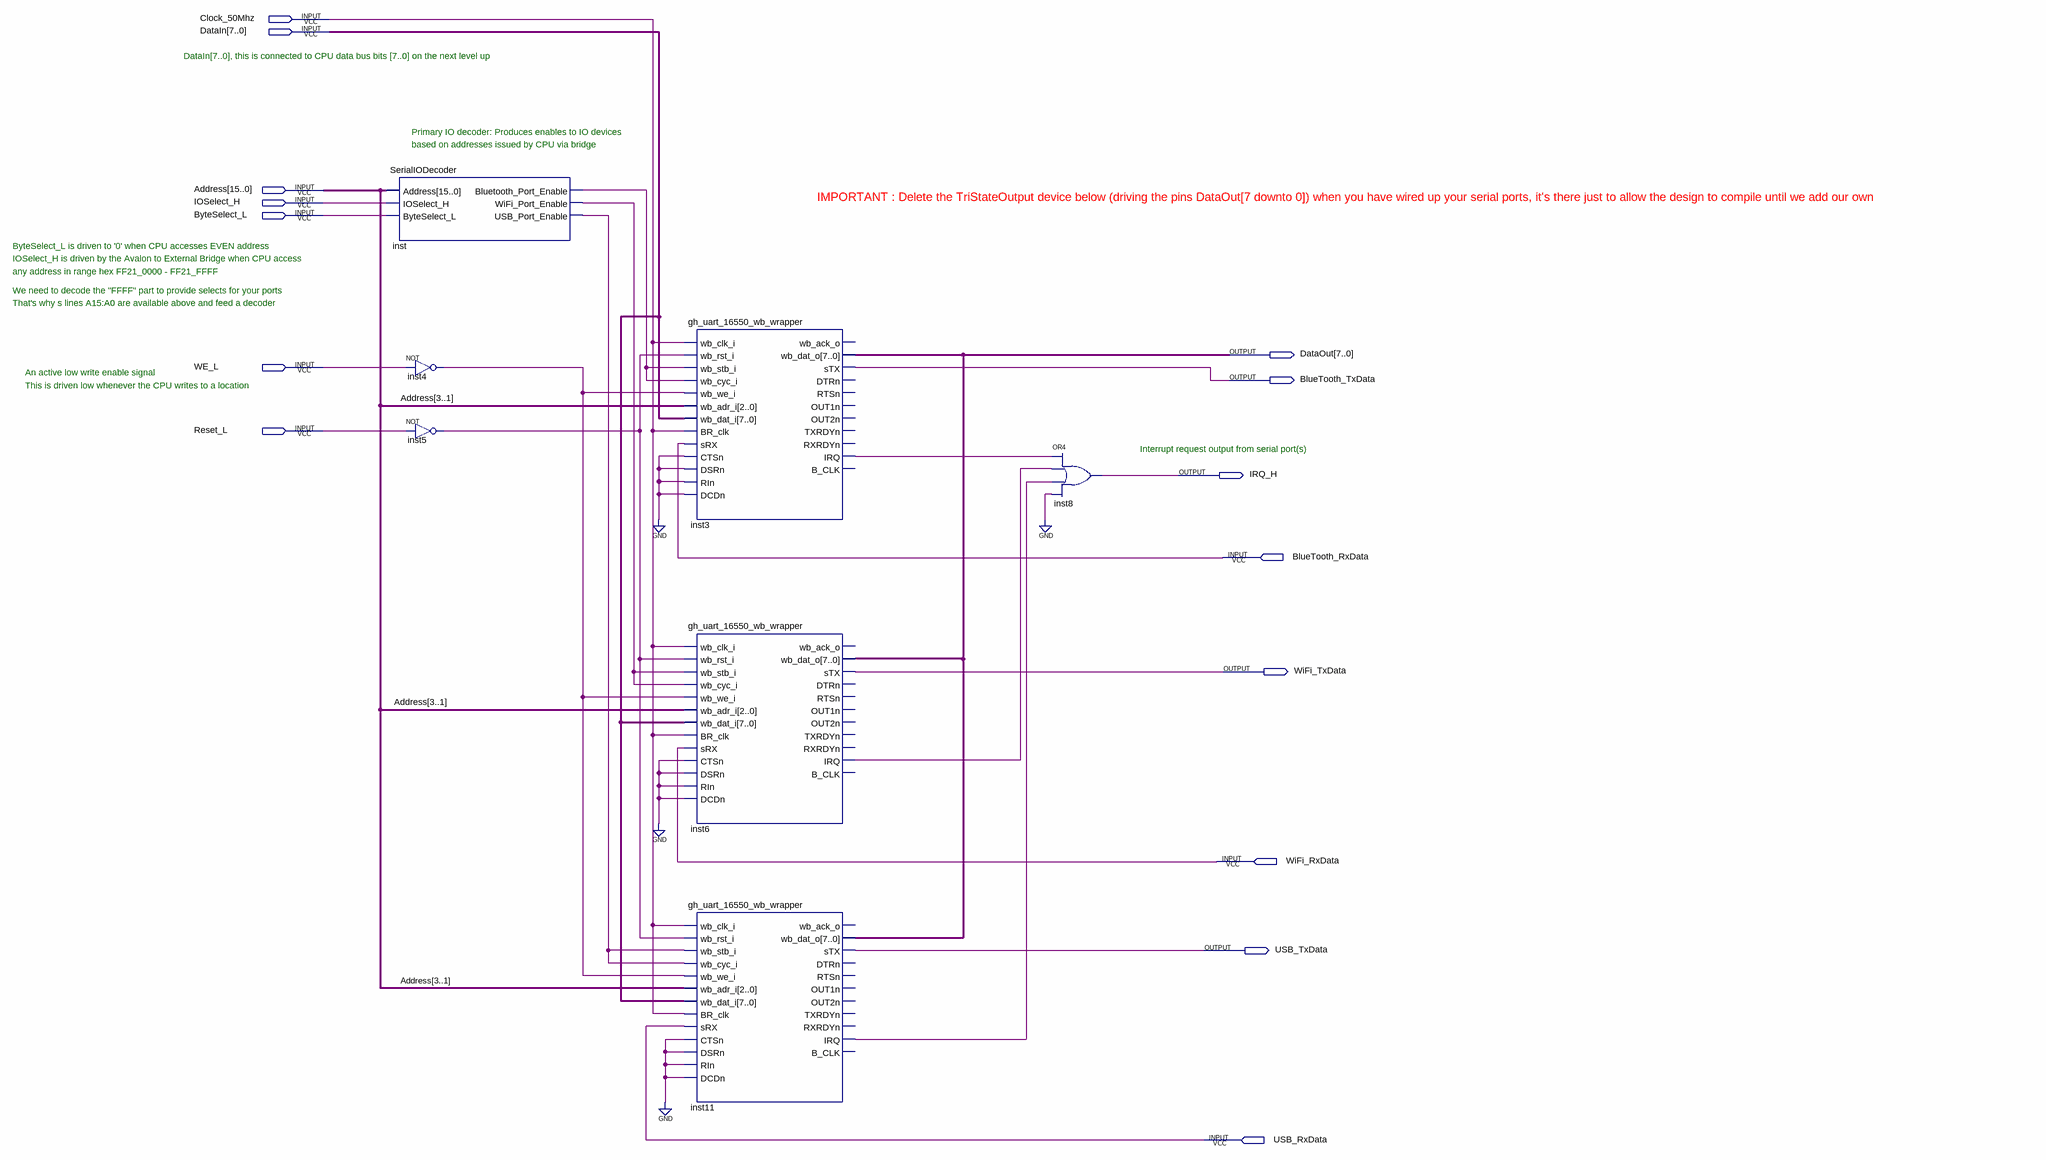
[diagram p0: schematic sheet]
// Quartus schematic OnChipSerialIO.bdf as structural Verilog: 7 symbols, 15 pins
module OnChipSerialIO (
  input  Clock_50Mhz,
  input  [7:0] DataIn,
  input  [15:0] Address,
  input  IOSelect_H,
  input  ByteSelect_L,
  input  WE_L,
  input  Reset_L,
  input  BlueTooth_RxData,
  input  WiFi_RxData,
  input  USB_RxData,
  output [7:0] DataOut,
  output BlueTooth_TxData,
  output IRQ_H,
  output WiFi_TxData,
  output USB_TxData
);

  wire inst3_irq, inst4_out, inst5_out, inst6_irq, inst11_irq, inst_bluetooth_port_enable,
       inst_usb_port_enable, inst_wifi_port_enable;

  SerialIODecoder inst (
    .Address(Address), .IOSelect_H(IOSelect_H), .ByteSelect_L(ByteSelect_L),
    .Bluetooth_Port_Enable(inst_bluetooth_port_enable), .WiFi_Port_Enable(inst_wifi_port_enable),
    .USB_Port_Enable(inst_usb_port_enable));
  not inst4 (inst4_out, WE_L);
  not inst5 (inst5_out, Reset_L);
  gh_uart_16550_wb_wrapper inst3 (
    .wb_clk_i(Clock_50Mhz), .wb_rst_i(inst5_out), .wb_stb_i(inst_bluetooth_port_enable),
    .wb_cyc_i(inst_bluetooth_port_enable), .wb_we_i(inst4_out), .wb_adr_i(Address[3:1]), .wb_dat_i(DataIn),
    .BR_clk(Clock_50Mhz), .sRX(BlueTooth_RxData), .CTSn(1'b0), .DSRn(1'b0), .RIn(1'b0), .DCDn(1'b0),
    .wb_dat_o(DataOut), .sTX(BlueTooth_TxData), .IRQ(inst3_irq));  // open: wb_ack_o, DTRn, RTSn, OUT1n, OUT2n, TXRDYn, RXRDYn, B_CLK
  gh_uart_16550_wb_wrapper inst6 (
    .wb_clk_i(Clock_50Mhz), .wb_rst_i(inst5_out), .wb_stb_i(inst_wifi_port_enable),
    .wb_cyc_i(inst_wifi_port_enable), .wb_we_i(inst4_out), .wb_adr_i(Address[3:1]), .wb_dat_i(DataIn),
    .BR_clk(Clock_50Mhz), .sRX(WiFi_RxData), .CTSn(1'b0), .DSRn(1'b0), .RIn(1'b0), .DCDn(1'b0),
    .wb_dat_o(DataOut), .sTX(WiFi_TxData), .IRQ(inst6_irq));  // open: wb_ack_o, DTRn, RTSn, OUT1n, OUT2n, TXRDYn, RXRDYn, B_CLK
  gh_uart_16550_wb_wrapper inst11 (
    .wb_clk_i(Clock_50Mhz), .wb_rst_i(inst5_out), .wb_stb_i(inst_usb_port_enable),
    .wb_cyc_i(inst_usb_port_enable), .wb_we_i(inst4_out), .wb_adr_i(Address[3:1]), .wb_dat_i(DataIn),
    .BR_clk(Clock_50Mhz), .sRX(USB_RxData), .CTSn(1'b0), .DSRn(1'b0), .RIn(1'b0), .DCDn(1'b0),
    .wb_dat_o(DataOut), .sTX(USB_TxData), .IRQ(inst11_irq));  // open: wb_ack_o, DTRn, RTSn, OUT1n, OUT2n, TXRDYn, RXRDYn, B_CLK
  or inst8 (IRQ_H, inst3_irq, inst6_irq, inst11_irq, 1'b0);

  // Notes on the sheet:
  //   DataIn[7..0], this is connected to CPU data bus bits [7..0] on the next level up
  //   Primary IO decoder: Produces enables to IO devices
  //   based on addresses issued by CPU via bridge
  //   IMPORTANT : Delete the TriStateOutput device below (driving the pins DataOut[7 downto 0]) when you have wired up your serial ports, it's there just to allow the design to compile until we add our own
  //   ByteSelect_L is driven to '0' when CPU accesses EVEN address
  //   IOSelect_H is driven by the Avalon to External Bridge when CPU access
  //   any address in range hex FF21_0000 - FF21_FFFF
  //   We need to decode the "FFFF" part to provide selects for your ports 
  //   That's why s lines A15:A0 are available above and feed a decoder
  //   An active low write enable signal
  //   This is driven low whenever the CPU writes to a location
  //   Interrupt request output from serial port(s)
endmodule
